# Altium schematic sheet LCD_Keypad.SchDoc
size B; Organization: Altium Limited; Address1: L3, 12a Rodborough Rd; Address2: Frenchs Forest; Address3: NSW; Address4: Australia 2086; DocumentNumber: 1; SheetNumber: 1; SheetTotal: 3
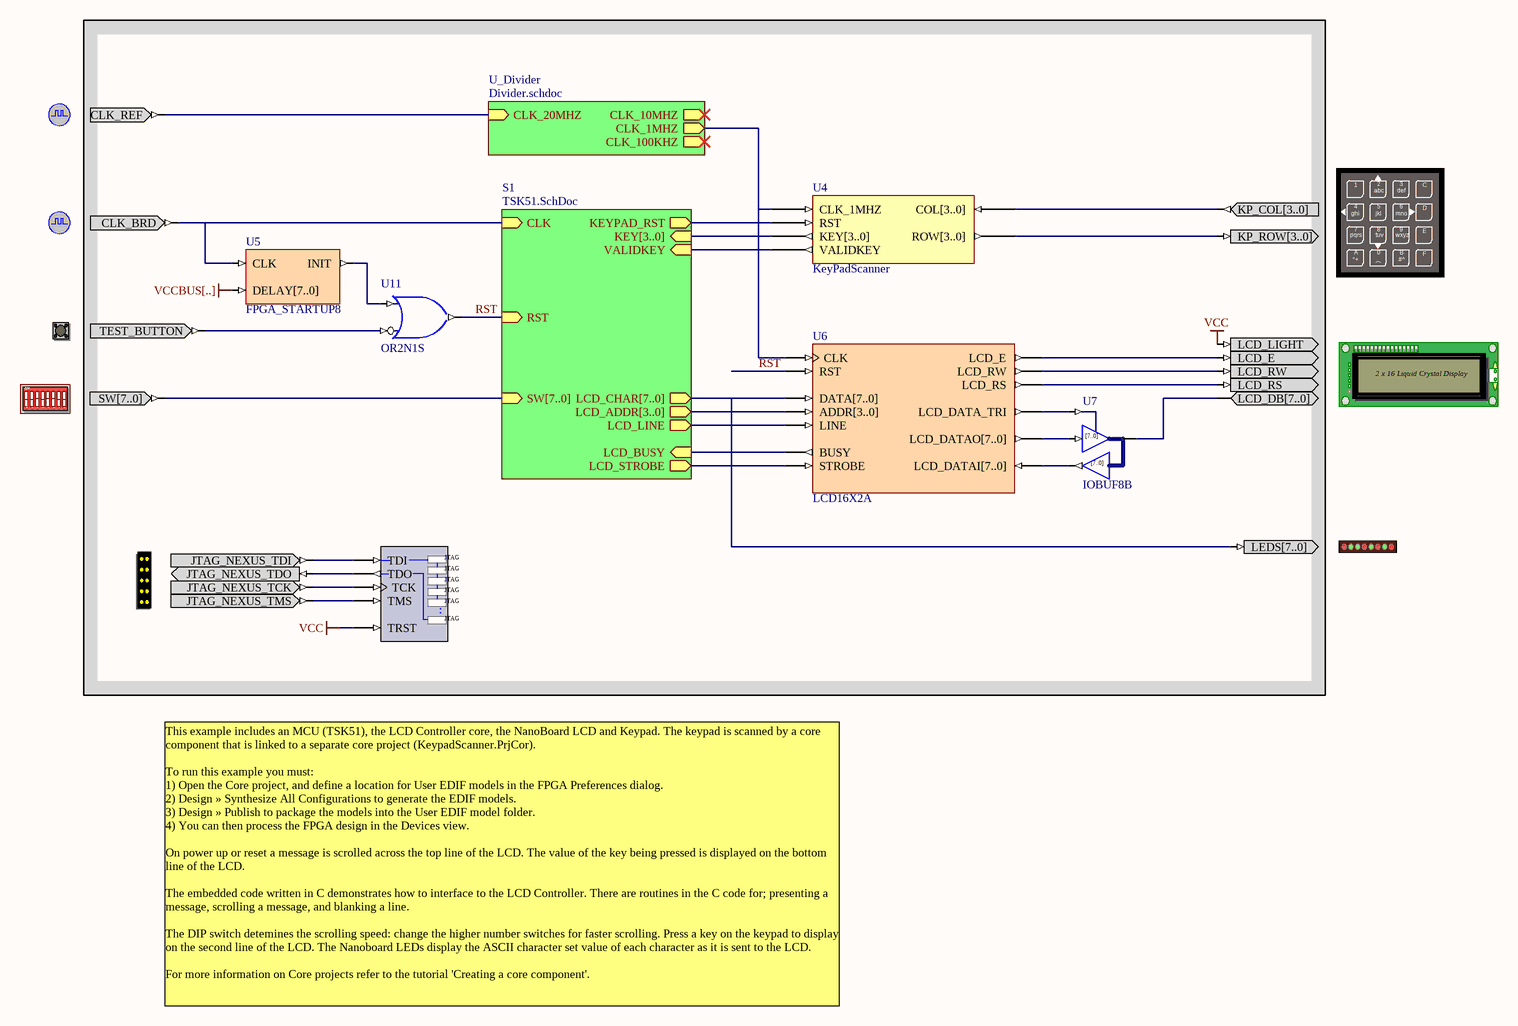
[diagram p0: LCD_Keypad.SchDoc]

## Parts
(Parts that share a designator on the sheet are numbered #1, #2 ... from top to bottom, then left to right.)
?#1  CLOCK_REFERENCE  (value not drawn)
?#2  KEYPAD  (value not drawn)
?#3  CLOCK_BOARD  (value not drawn)
?#4  TEST_BUTTON  (value not drawn)
?#5  LCD  (value not drawn)
?#6  DIPSWITCH  (value not drawn)
?#7  LED  (value not drawn)
?#8  NEXUS_JTAG_CONNECTOR  (value not drawn)
NEXUS_JTAG_PORT  NEXUS_JTAG_PORT  (value not drawn)
U4  KeyPadScanner
U5  FPGA_STARTUP8
U6  LCD16X2A
U7  IOBUF8B
U11  OR2N1S

## Sub-sheets
S1 = TSK51.SchDoc: CLK (in), RST (in), KEY[3..0] (in), LCD_CHAR[7..0] (out), LCD_ADDR[3..0] (out), SW[7..0] (in), VALIDKEY (in), LCD_BUSY (in), LCD_STROBE (out), LCD_LINE (out), KEYPAD_RST (out)
U_Divider = Divider.schdoc: CLK_100KHZ (out), CLK_1MHZ (out), CLK_10MHZ (out), CLK_20MHZ (in)

## Nets
VCC: ?#5.LCD_LIGHT NEXUS_JTAG_PORT.TRST
VCCBUS[..]: U5.DELAY[7..0]
RST: U6.RST U11.O ; sheet S1/RST
Net?#1_CLK_REF: ?#1.CLK_REF ; sheet U_Divider/CLK_20MHZ
Net?#2_KP_COL[3..0]: ?#2.KP_COL[3..0] U4.COL[3..0]
Net?#2_KP_ROW[3..0]: ?#2.KP_ROW[3..0] U4.ROW[3..0]
Net?#3_CLK_BRD: ?#3.CLK_BRD U5.CLK ; sheet S1/CLK
Net?#4_TEST_BUTTON: ?#4.TEST_BUTTON U11.I0
Net?#5_LCD_DB[7..0]: ?#5.LCD_DB[7..0] U7.IO[7..0]
Net?#5_LCD_E: ?#5.LCD_E U6.LCD_E
Net?#5_LCD_RS: ?#5.LCD_RS U6.LCD_RS
Net?#5_LCD_RW: ?#5.LCD_RW U6.LCD_RW
Net?#6_SW[7..0]: ?#6.SW[7..0] ; sheet S1/SW[7..0]
Net?#7_LEDS[7..0]: ?#7.LEDS[7..0] U6.DATA[7..0] ; sheet S1/LCD_CHAR[7..0]
Net?#8_JTAG_NEXUS_TCK: ?#8.JTAG_NEXUS_TCK NEXUS_JTAG_PORT.TCK
Net?#8_JTAG_NEXUS_TDI: ?#8.JTAG_NEXUS_TDI NEXUS_JTAG_PORT.TDI
Net?#8_JTAG_NEXUS_TDO: ?#8.JTAG_NEXUS_TDO NEXUS_JTAG_PORT.TDO
Net?#8_JTAG_NEXUS_TMS: ?#8.JTAG_NEXUS_TMS NEXUS_JTAG_PORT.TMS
NetU4_CLK_1MHZ: U4.CLK_1MHZ U6.CLK ; sheet U_Divider/CLK_1MHZ
NetU4_KEY[3..0]: U4.KEY[3..0] ; sheet S1/KEY[3..0]
NetU4_RST: U4.RST ; sheet S1/KEYPAD_RST
NetU4_VALIDKEY: U4.VALIDKEY ; sheet S1/VALIDKEY
NetU5_INIT: U5.INIT U11.I1
NetU6_ADDR[3..0]: U6.ADDR[3..0] ; sheet S1/LCD_ADDR[3..0]
NetU6_BUSY: U6.BUSY ; sheet S1/LCD_BUSY
NetU6_LCD_DATA_TRI: U6.LCD_DATA_TRI U7.T
NetU6_LCD_DATAI[7..0]: U6.LCD_DATAI[7..0] U7.O[7..0]
NetU6_LCD_DATAO[7..0]: U6.LCD_DATAO[7..0] U7.I[7..0]
NetU6_LINE: U6.LINE ; sheet S1/LCD_LINE
NetU6_STROBE: U6.STROBE ; sheet S1/LCD_STROBE

## Notes on the sheet
- This example includes an MCU (TSK51), the LCD Controller core, the NanoBoard LCD and Keypad. The keypad is scanned by a core component that is linked to a separate core project (KeypadScanner.PrjCor).
  To run this example you must:
  1) Open the Core project, and define a location for User EDIF models in the FPGA Preferences dialog.
  2) Design » Synthesize All Configurations to generate the EDIF models.
  3) Design » Publish to package the models into the User EDIF model folder.
  4) You can then process the FPGA design in the Devices view.
  On power up or reset a message is scrolled across the top line of the LCD. The value of the key being pressed is displayed on the bottom line of the LCD.
  The embedded code written in C demonstrates how to interface to the LCD Controller. There are routines in the C code for; presenting a message, scrolling a message, and blanking a line.
  The DIP switch detemines the scrolling speed: change the higher number switches for faster scrolling. Press a key on the keypad to display on the second line of the LCD. The Nanoboard LEDs display the ASCII character set value of each character as it is sent to the LCD.
  For more information on Core projects refer to the tutorial 'Creating a core component'.
- Title
- Size:
- Date:
- B
- Number:
- Time:
- Revision:
- Sheet
- of
- File:
- (in symbol DIPSWITCH) ON; 1; 2; 3; 4; 5; 6; 7; 8
- (in symbol IOBUF8B) [7..0]
- (in symbol KEYPAD) 1; 2; 3; C; abc; def; 4; 5; 6; ghi; jkl; mno; D; 7; 8; 9; E; pqrs; tuv; wxyz; A; 0; B; F; *+; (; #^
- (in symbol LCD) 2 x 16 Liquid Crystal Display
- (in symbol NEXUS_JTAG_PORT) JTAG; .

## Library data of the parts
?#1 = CLOCK_REFERENCE: Global System Clock Reference Supply; PortComponent: True; Published: 19-Nov-2003; Publisher: Altium Limited
?#2 = KEYPAD: Key Pad; PortComponent: True; Published: 19-Nov-2003; Publisher: Altium Limited
?#3 = CLOCK_BOARD: Global System Clock Supply; PortComponent: True; Published: 19-Nov-2003; Publisher: Altium Limited
?#4 = TEST_BUTTON: Test Button; PortComponent: True; Published: 19-Nov-2003; Publisher: Altium Limited
?#5 = LCD: Liquid Crystal Display; PortComponent: True; Published: 19-Nov-2003; Publisher: Altium Limited
?#6 = DIPSWITCH: 8-Way Dip Switch; PortComponent: True; Published: 19-Nov-2003; Publisher: Altium Limited
?#7 = LED: 8-Way LEDS; PortComponent: True; Published: 19-Nov-2003; Publisher: Altium Limited
?#8 = NEXUS_JTAG_CONNECTOR: JTAG Port; PortComponent: True; Published: 19-Nov-2003; Publisher: Altium Limited
NEXUS_JTAG_PORT = NEXUS_JTAG_PORT: Soft Nexus-Chain Connector; NEXUS_JTAG_CONNECTOR: True; Published: 18-Dec-2003; Publisher: Altium Limited
U4 = KeyPadScanner: ChildModel1: FDC; ChildModel2: FD4CB; ChildModel3: AND4S; ChildModel4: NAND4B; ChildModel5: FD; ChildModel6: INV4B; ChildModel7: E4_2B; ChildModel8: INV; ChildModel9: CB2CEB; ChildModel10: D2_4EB; ChildModel11: CDIV64; ChildModel12: CDIV4
U5 = FPGA_STARTUP8: FPGA Startup With 8 Bit Delay; Published: 21/01/2004; Publisher: Altium Hobart Technology Centre; Core Revision: 1.00.00
U6 = LCD16X2A: LCD Controller; Published: 5/01/2004; Publisher: Altium Hobart Technology Centre; Core Revision: 1.00.00
U7 = IOBUF8B: 8-Bit Input/Output Buffer, Bus Version; ArchiveName: GENERIC; Published: 18-Dec-2003; Publisher: Altium Limited; Core Revision: 1.00.00
U11 = OR2N1S: 2-Input OR Gate with Active Low A Input, Single Pin Version; Xilinx Equivalent: OR2B1; ArchiveName: GENERIC; Published: 18-Dec-2003; Publisher: Altium Limited; Core Revision: 1.00.00